# EAGLE design Adafruit 1.54inch 240x240 rev G (EAGLE 9.3.2)
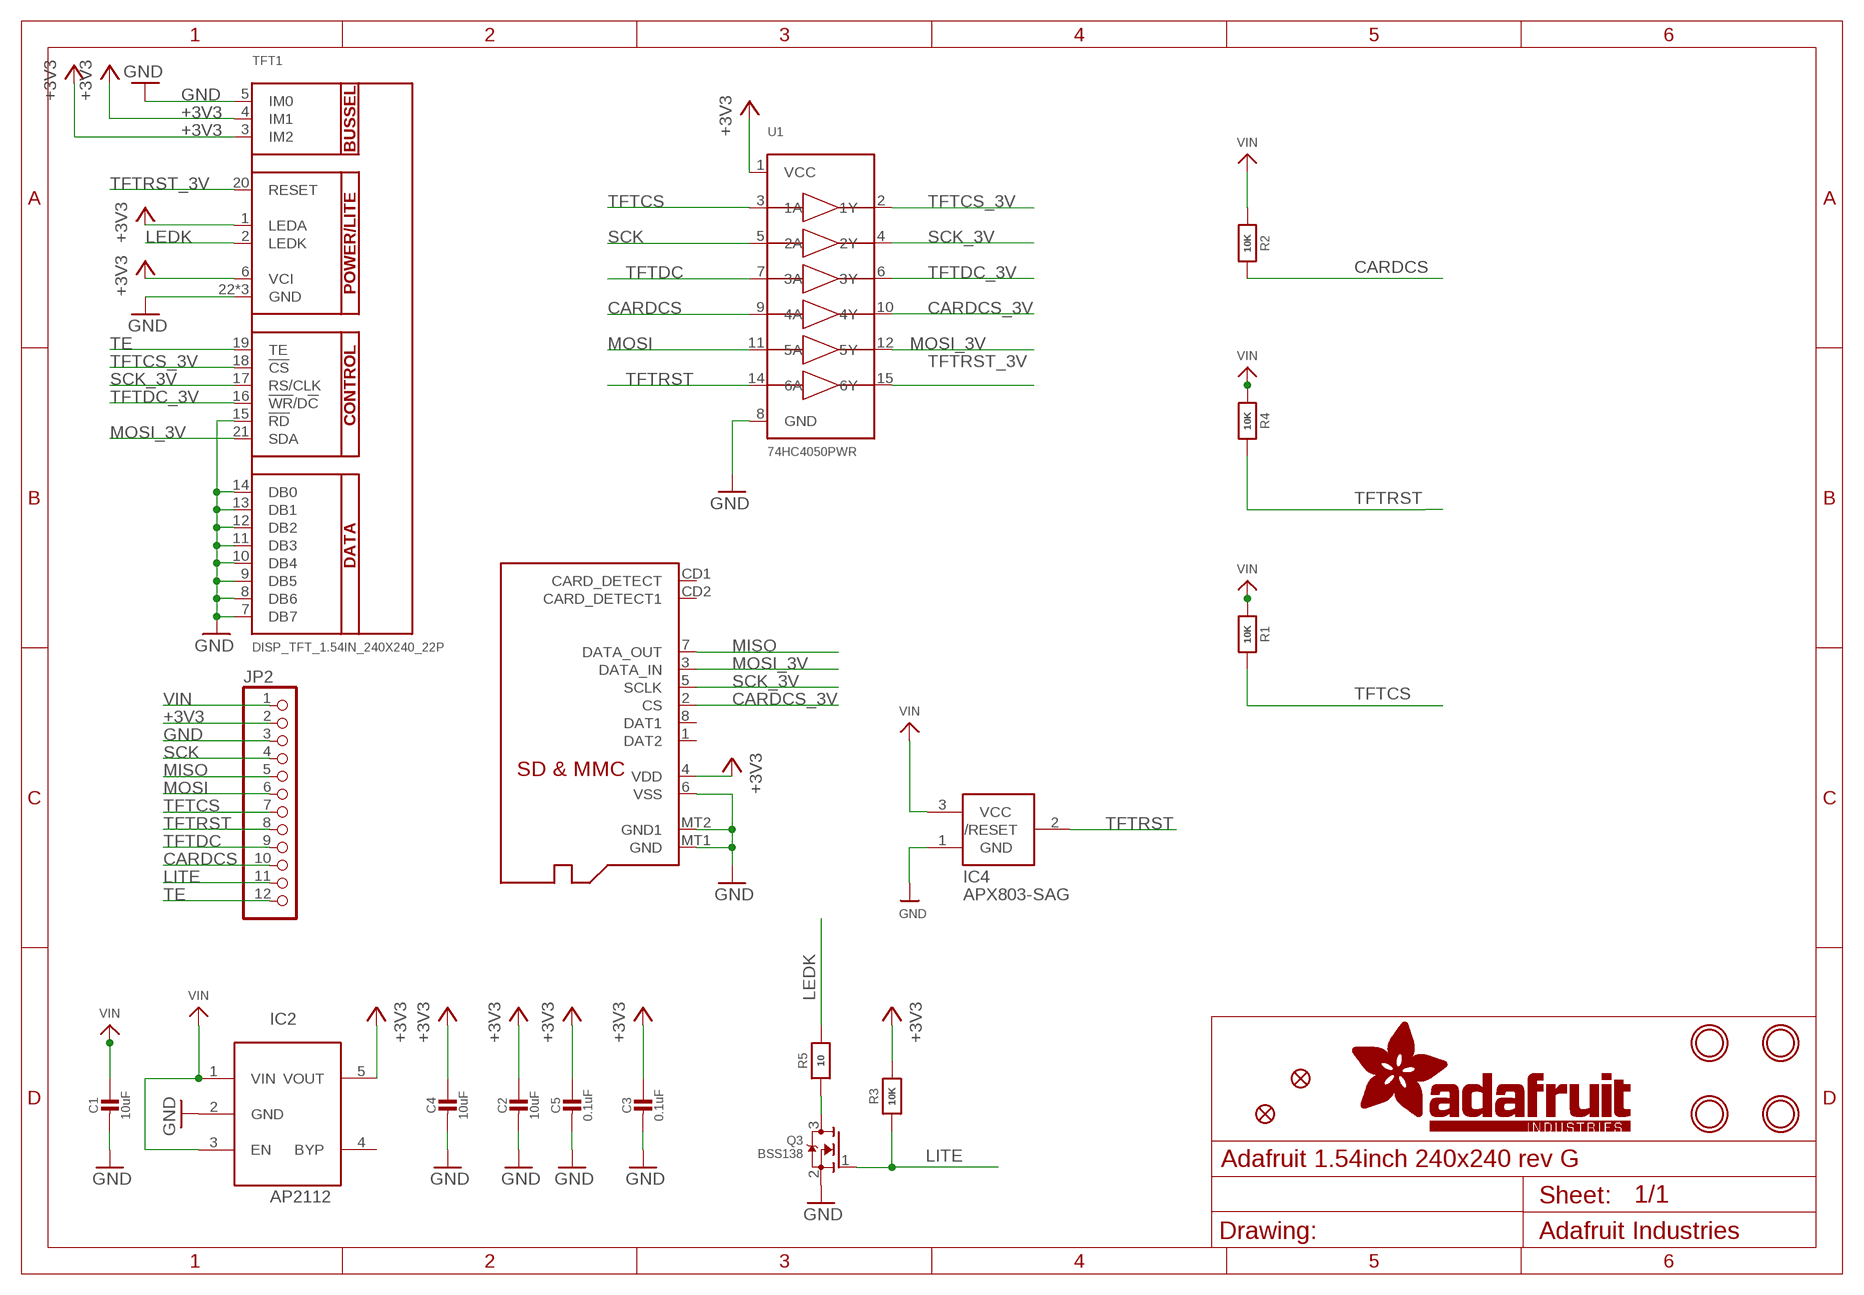
[diagram p0: schematic, sheet 1]

## Parts
C1  10uF  CAP_CERAMIC0805-NOOUTLINE  [0805-NO]
C2  10uF  CAP_CERAMIC0805-NOOUTLINE  [0805-NO]
C3  0.1uF  CAP_CERAMIC0603_NO  [0603-NO]
C4  10uF  CAP_CERAMIC0805-NOOUTLINE  [0805-NO]
C5  0.1uF  CAP_CERAMIC0603_NO  [0603-NO]
IC2  AP2112  LP298XS  [SOT23-5L]
IC4  APX803-SAG  AXP083-SAG  [SOT23]
JP2  HEADER-1X1276MIL  [1X12_ROUND_76MIL]
Q2  MICROSD  [MICROSD]
Q3  BSS138  MOSFET-NWIDE  [SOT23-WIDE]
R1  10K  RESISTOR_0603_NOOUT  [0603-NO]
R2  10K  RESISTOR_0603_NOOUT  [0603-NO]
R3  10K  RESISTOR_0603_NOOUT  [0603-NO]
R4  10K  RESISTOR_0603_NOOUT  [0603-NO]
R5  10  RESISTOR_0603_NOOUT  [0603-NO]
TFT1  DISP_TFT_1.54IN_240X240_22P  [TFT_1.54IN_240X240_22PIN]
U1  74HC4050PWR  74HC4050DTSSOP  [TSSOP16]
U$4  FIDUCIAL_1MM  [FIDUCIAL_1MM]
U$5  FIDUCIAL_1MM  [FIDUCIAL_1MM]
U$7  MOUNTINGHOLE2.5  [MOUNTINGHOLE_2.5_PLATED]
U$8  MOUNTINGHOLE2.5  [MOUNTINGHOLE_2.5_PLATED]
U$9  MOUNTINGHOLE2.5  [MOUNTINGHOLE_2.5_PLATED]
U$10  MOUNTINGHOLE2.5  [MOUNTINGHOLE_2.5_PLATED]

## Nets
+3V3 [power]: C2.1 C3.1 C4.1 C5.1 IC2.5(VOUT) JP2.2 Q2.4(VDD) R3.2 TFT1.1(LEDA) TFT1.3(IM2) TFT1.4(IM1) TFT1.6(VCI) U1.1(VCC)
CARDCS: JP2.10 R2.1 U1.9(4A)
CARDCS_3V: Q2.2(CS) U1.10(4Y)
GND: C1.2 C2.2 C3.2 C4.2 C5.2 IC2.2(GND) IC4.1(GND) JP2.3 Q2.6(VSS) Q2.MT1(GND) Q2.MT2(GND1) Q3.2(S) TFT1.5(IM0) TFT1.7(DB7) TFT1.8(DB6) TFT1.9(DB5) TFT1.10(DB4) TFT1.11(DB3) TFT1.12(DB2) TFT1.13(DB1) TFT1.14(DB0) TFT1.15(!RD) TFT1.22(GND) TFT1.SUPPORT1(GND) TFT1.SUPPORT2(GND) U1.8(GND)
LEDK: R5.2 TFT1.2(LEDK)
LITE: JP2.11 Q3.1(G) R3.1
MISO: JP2.5 Q2.7(DATA_OUT)
MOSI: JP2.6 U1.11(5A)
MOSI_3V: Q2.3(DATA_IN) TFT1.21(SDA) U1.12(5Y)
N$1: Q3.3(D) R5.1
SCK: JP2.4 U1.5(2A)
SCK_3V: Q2.5(SCLK) TFT1.17(RS/CLK) U1.4(2Y)
TE: JP2.12 TFT1.19(TE)
TFTCS: JP2.7 R1.1 U1.3(1A)
TFTCS_3V: TFT1.18(!CS) U1.2(1Y)
TFTDC: JP2.9 U1.7(3A)
TFTDC_3V: TFT1.16(!WR!/D!C) U1.6(3Y)
TFTRST: IC4.2(/RESET) JP2.8 R4.1 U1.14(6A)
TFTRST_3V: TFT1.20(RESET) U1.15(6Y)
VIN [power]: C1.1 IC2.1(VIN) IC2.3(EN) IC4.3(VCC) JP2.1 R1.2 R2.2 R4.2
Unconnected: IC2.4(BYP) Q2.1(DAT2) Q2.8(DAT1) Q2.CD1(CARD_DETECT) Q2.CD2(CARD_DETECT1)

## Library data of the parts
C1-C5 = microbuilder:CAP_CERAMIC: Ceramic Capacitors For new designs, use the packages preceded by an '_' character since they are more reliable: The following footprints should be used on most boards: _0402 - Standard footprint for regular board layouts _0603 - Standard footprint for regular board layouts _0805 - Standard footprint for regular board layouts _1206 - Standard footprint for regular board layouts For extremely tight-pitch boards where space is at a premium, the following 'micro-pitch' footprints can be used (smaller pads, no silkscreen outline, etc.): _0402MP - Micro-pitch footprint for very dense/compact boards _0603MP - Micro-pitch footprint for very dense/compact boards _0805MP - Micro-pitch footprint for very dense/compact boards _1206MP - Micro-pitch footprint for very dense/compact boards
IC2 = adafruit:LP298X
IC4 = adafruit:AXP083
JP2 = microbuilder:HEADER-1X12
Q2 = adafruit:MICROSD: Micro-SD / Transflash card holder with SPI pinout For the 3M # 2908-05WB-MG and/or 4UCON #19656 push-push type
Q3 = microbuilder:MOSFET-N: N-Channel Mosfet LEGEND VDS: Voltage Drain-Source ID: Drain Current RDS(ON): Drain-Source On-State Resistance VGS(TH): Gate-Source Threshold Voltage CISS: Drain-Source Input Capacitance SOT-23 Name VDS ID RDS(ON) VGS(TH) CISS Order Number 2N7002E 60V 260mA 2.5 Ohm 2.5V @ 250uA 26.7pF @ 25V 2N7002ET1GOSTR-ND BSH103 30V 850mA 400 mOhm 400mV @ 1mA 83pF @ 24V BSH103,235-ND BSS138 60V 320mA 1.6 Ohm 1.5V @ 250uA 50pF @ 10V Mouser: 771-BSS138PW115 DMN2075U-7 20V 4.2A 38 mOhm 1V @ 250 uA 594.3pF @ 10V DMN2075U-7DICT-ND * BSS138 good choice for I2C level-shifting POWERPAK 1212-8 Name VDS ID RDS(ON) VGS(TH) CISS Order Number Si7308DN 60V 6A 58 mOhm 3V @ 250uA 665pF @ 15V SI7308DN-T1-E3CT-ND
R1-R5 = microbuilder:RESISTOR: Resistors For new designs, use the packages preceded by an '_' character since they are more reliable: The following footprints should be used on most boards: _0402 - Standard footprint for regular board layouts _0603 - Standard footprint for regular board layouts _0805 - Standard footprint for regular board layouts _1206 - Standard footprint for regular board layouts For extremely tight-pitch boards where space is at a premium, the following 'micro-pitch' footprints can be used (smaller pads, no silkscreen outline, etc.): _0402MP - Micro-pitch footprint for very dense/compact boards _0603MP - Micro-pitch footprint for very dense/compact boards _0805MP - Micro-pitch footprint for very dense/compact boards _1206MP - Micro-pitch footprint for very dense/compact boards
TFT1 = microbuilder:DISP_TFT_1.54IN_240X240_22P
U1 = microbuilder:74HC4050D: 6-channel level shifter 74HC4050D - 2V-6V Supply SOIC16 Digikey: 74HC4050D,653-ND Mouser: 771-74HC4050D-T TSSOP16 Digikey: 296-9215-1-ND Mouser:
U$4 U$5 = microbuilder:FIDUCIAL: Fiducial Alignment Points Various fiducial points for machine vision alignment.; BOM: EXCLUDE
U$7-U$10 = microbuilder:MOUNTINGHOLE: Mounting Hole For #2 screws (0.086"/2.18mm width, 0.094"/2.4mm hole) use 2.5mm; BOM: EXCLUDE

## Net classes
1 power: width 0.254 mm

## Board
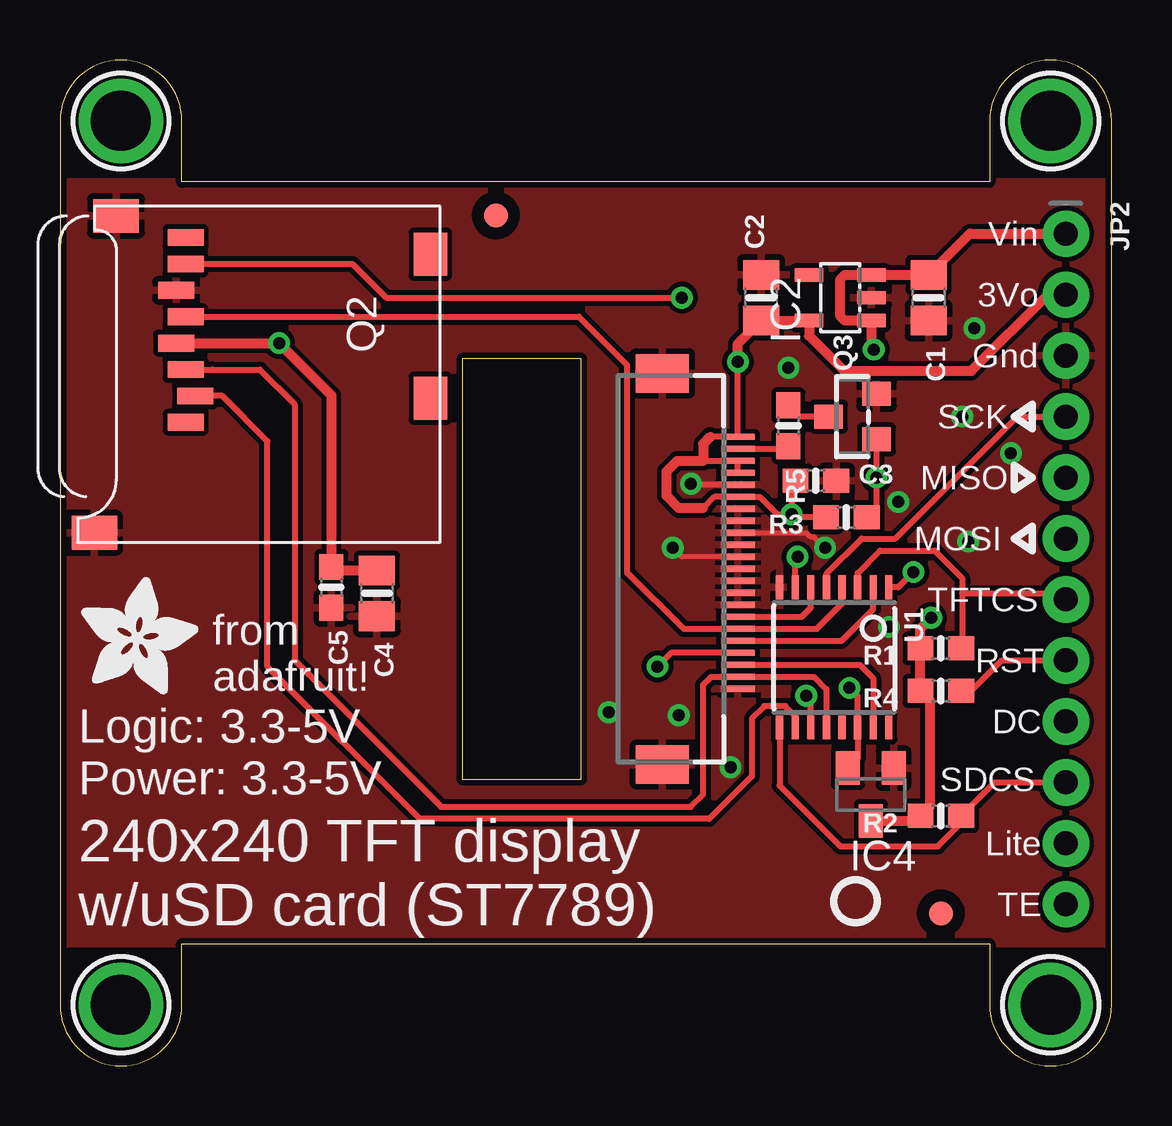
[diagram p1: board, top side]
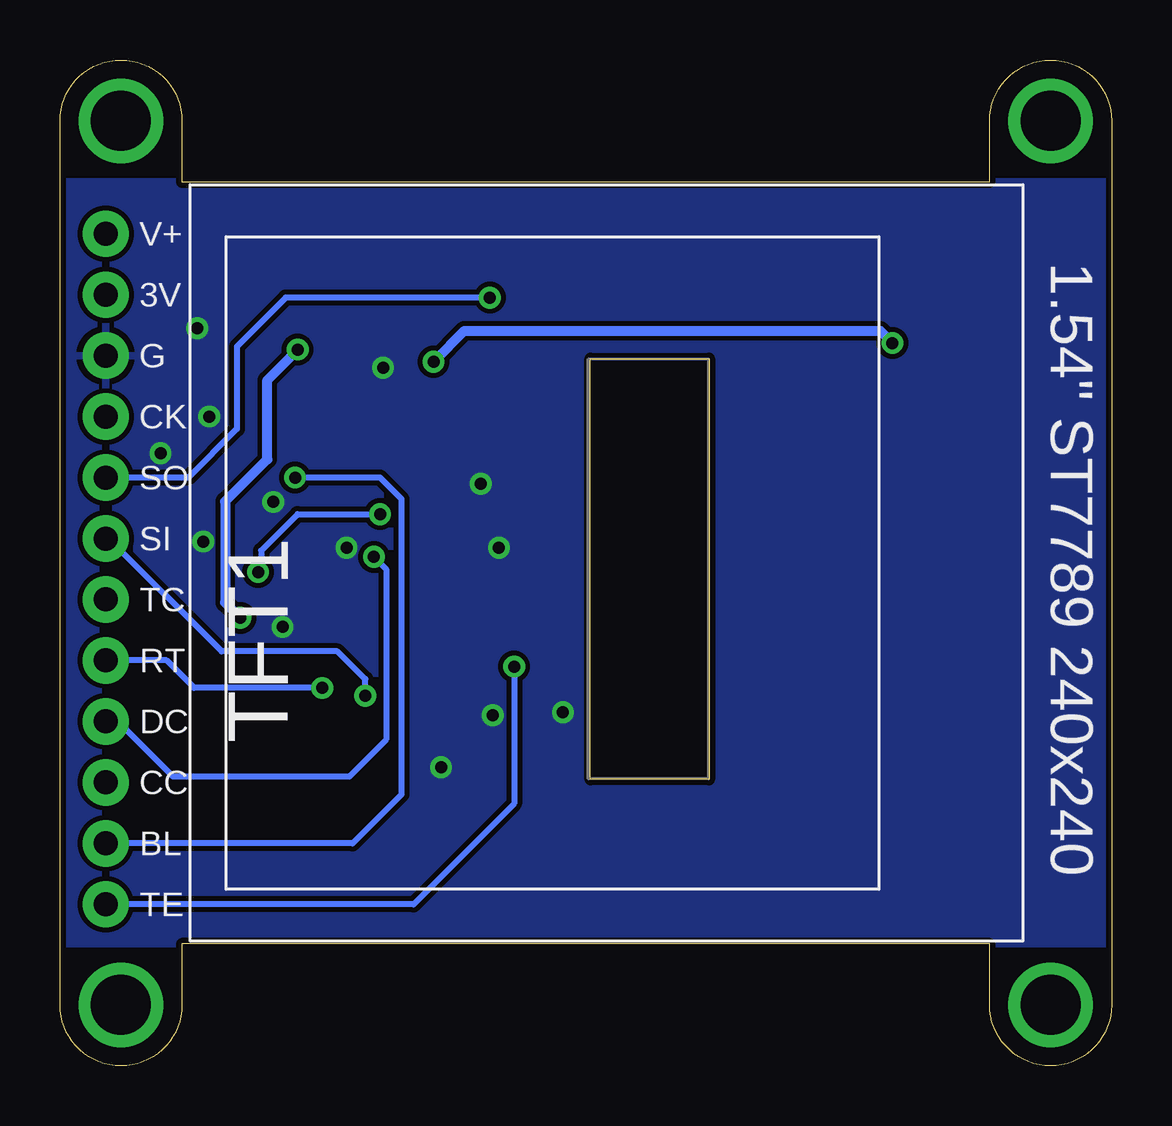
[diagram p2: board, bottom side, seen from below]

Size 43.81 x 41.91 mm. Coordinates in mm from the lower left corner, seen from the top.
Outline: 38.73,5.08 38.73,2.54 arc90 41.27,0 arc90 43.81,2.54 43.81,39.37 arc90 41.27,41.91 arc90 38.73,39.37 38.73,36.83 5.08,36.83 5.08,39.37 arc90 2.54,41.91 arc90 0,39.37 0,2.54 arc90 2.54,0 arc90 5.08,2.54 5.08,5.08 38.73,5.08
Outline: 16.76,29.46 16.76,11.94 21.72,11.94 21.72,29.46 16.76,29.46
Copper layers (1*16): Top 0.035mm / dielectric 1.5mm / Bottom 0.035mm
Design rules "adafruit *": minimum track width 8mil, minimum drill 15.5mil, track to track 8mil, track to pad 8mil, pad to pad 8mil, via to via 8mil, smd to smd 8mil, copper to edge 10mil, drill to drill 8mil, minimum pad ring 10mil, minimum via ring 8mil, stop-mask expansion 2mil, vias tented up to drill 20mil, thermal gap 10mil

### Footprints (pad centres in the part's own frame; a part is rotated, then mirrored left to right if it is on the bottom)
0805-NO = smd 1.24 x 1.5: 1 -0.95,0; 2 0.95,0
0603-NO = smd 1.075 x 1: 1 -0.85,0; 2 0.85,0
SOT23-5L = smd 0.55 x 1.2: 1 -0.95,-1.3; 2 0,-1.3; 3 0.95,-1.3; 4 0.95,1.3; 5 -0.95,1.3
SOT23 = smd 1 x 1.4: 1 -0.95,-1.1; 2 0.95,-1.1; 3 0,1.1
1X12_ROUND_76MIL = drill 1 pad 1.93: 1 -13.97,0; 2 -11.43,0; 3 -8.89,0; 4 -6.35,0; 5 -3.81,0; 6 -1.27,0; 7 1.27,0; 8 3.81,0; 9 6.35,0; 10 8.89,0; 11 11.43,0; 12 13.97,0
MICROSD = smd 0.7 x 1.5: 1 9,-10.64; 2 7.9,-10.24; 3 6.8,-10.64; 4 5.7,-11.04; 5 4.6,-10.64; 6 3.5,-11.04; 7 2.4,-10.64; 8 1.3,-10.64 | smd 1.8 x 1.4: CD1 2,-0.44; CD2 8,-0.44 | smd 1.4 x 1.9: MT1 0.4,-13.54; MT2 13.6,-14.44
SOT23-WIDE = smd 1 x 1.2: 1 -0.95,-1; 2 0.95,-1; 3 0,1
TFT_1.54IN_240X240_22PIN = smd 0.25 x 1.4 bottom: 1 5.25,2.722; 2 4.75,2.722; 3 4.25,2.722; 4 3.75,2.722; 5 3.25,2.722; 6 2.75,2.722; 7 2.25,2.722; 8 1.75,2.722; 9 1.25,2.722; 10 0.75,2.722; 11 0.25,2.722; 12 -0.25,2.722; 13 -0.75,2.722; 14 -1.25,2.722; 15 -1.75,2.722; 16 -2.25,2.722; 17 -2.75,2.722; 18 -3.25,2.722; 19 -3.75,2.722; 20 -4.25,2.722; 21 -4.75,2.722; 22 -5.25,2.722 | smd 1.6 x 2.2 bottom: SUPPORT1 7.9,-0.428; SUPPORT2 -8.4,-0.428
TSSOP16 = smd 0.305 x 0.991: 1 -2.275,-2.918; 2 -1.625,-2.918; 3 -0.975,-2.918; 4 -0.325,-2.918; 5 0.325,-2.918; 6 0.975,-2.918; 7 1.625,-2.918; 8 2.275,-2.918; 9 2.275,2.918; 10 1.625,2.918; 11 0.975,2.918; 12 0.325,2.918; 13 -0.325,2.918; 14 -0.975,2.918; 15 -1.625,2.918; 16 -2.275,2.918
FIDUCIAL_1MM = smd 1 x 1: 1 0,0
MOUNTINGHOLE_2.5_PLATED = drill 2.5 pad 3.2: P$1 0,0

### Placement (x,y rotation side)
C1  36.2,32 270 top
C2  29.21,32 90 top
C3  31.5,24.38 0 top
C4  13.21,19.69 270 top
C5  11.3,19.94 270 top
IC2  32.51,32 90 top
IC4  33.78,11.3 180 top
JP2  41.91,20.7 270 top
Q2  15.88,35.81 270 top
Q3  33.02,27.05 90 top
R1  36.7,17.4 180 top
R2  36.7,10.41 180 top
R3  32.77,22.86 180 top
R4  36.7,15.62 180 top
R5  30.35,26.67 270 top
TFT1  25.53,20.95 90 bottom
U1  32.26,17.02 180 top
U$1  [ADAFRUIT_5MM]  0.89,15.49 0 top
U$2  [PCBFEAT-REV-040]  33.15,6.86 180 top
U$4  18.16,35.43 0 top
U$5  36.7,6.35 0 top
U$7  2.54,39.37 0 top
U$8  2.54,2.54 0 top
U$9  41.27,39.37 0 top
U$10  41.27,2.54 0 top

### Tracks (layer width: path | path; a pad name or v marks a point on that pad's centre or on a via)
+3V3  (via drill 0.5)
  Top 0.254: v28.25,29.34 TFT1.1 27.09,26.2 | v30.48,22.99 29.88,22.99 29.17,23.7 TFT1.6 27.26,23.7 26.8,23.24 | 32,22.86 R3.2 30.61,22.86 v30.48,22.99 | 37.97,28.96 39.88,30.86 | v35.56,20.57 34.92,19.94 U1.1 | 11.46,20.63 C5.1 | C3.1 30.48,24.22 v30.48,22.99 | 26.8,25.2 TFT1.3 TFT1.4
  Top 0.406: v28.25,29.34 28.25,30.09 C2.1 IC2.5 31.21,30.42 32.67,28.96 37.97,28.96 41.15,32.13 JP2.2 | C4.1 11.46,20.63 | Q2.4 v9.13,30.11 11.3,27.94 C5.1 | 26.8,23.24 25.78,23.24 25.27,23.75 25.27,24.77 25.71,25.2 26.8,25.2 26.8,25.91 27.09,26.2
  Bottom 0.254: v35.56,20.57 35.43,20.7 35.43,21.46 33.91,22.99 v30.48,22.99
  Bottom 0.406: v9.13,30.11 9.64,30.62 26.96,30.62 v28.25,29.34
CARDCS
  Top 0.254: U1.9 29.98,11.67 32.51,9.14 36.58,9.14 37.55,10.12 R2.1 38.95,11.81 JP2.10
CARDCS_3V
  Top 0.254: U1.10 30.63,14.58 30.23,14.99 29.34,14.99 28.83,14.48 28.83,12.07 27.05,10.29 14.99,10.29 8.64,16.64 8.64,26.03 6.76,27.91 Q2.2
GND  (via drill 0.5)
  Top 0.203: TFT1.9 31.1,22.2 31.25,22.05 31.41,22.05 v31.88,21.59 | TFT1.11 25.91,21.2 v25.53,21.59
  Top 0.254: TFT1.5 26.34,24.2 v26.29,24.26
  other vias: 25.78,14.61 27.94,12.45 37.85,21.84 34.92,23.49 39.62,25.53 37.59,27.05 30.35,29.08 38.1,30.73 34.54,18.29 22.86,14.73
  pour Top: 0,5.08 0,36.83 43.56,36.83 43.56,5.08
  pour Bottom: 0,5.08 0,36.83 43.56,36.83 43.56,5.08
LEDK
  Top 0.254: TFT1.2 30.47,25.7 R5.2
LITE  (via drill 0.5)
  Top 0.254: Q3.1 v34.02,24.51 34.02,23.26 R3.1
  Bottom 0.254: v34.02,24.51 30.48,24.51 29.59,23.62 29.59,11.3 31.62,9.27 JP2.11
MISO  (via drill 0.5)
  Top 0.254: Q2.7 12.18,33.41 13.59,32 v25.91,32
  Bottom 0.254: v25.91,32 34.42,32 36.45,29.97 36.45,26.54 38.48,24.51 JP2.5
MOSI  (via drill 0.5)
  Top 0.254: U1.11 31.28,15.2 31.09,15.39 v31.09,15.42
  Bottom 0.254: v31.09,15.42 31.09,16.11 32.26,17.27 37.08,17.27 41.78,21.97 JP2.6
MOSI_3V
  Top 0.254: U1.12 31.93,15.69 31.42,16.2 TFT1.21 27.13,16.2 26.8,15.88 26.8,11.3 26.29,10.79 15.88,10.79 9.78,16.89 9.78,27.56 8.32,29.01 6.35,29.01 Q2.3 | Q2.3
N$1
  Top 0.254: Q3.3 30.82,27.05 R5.1
SCK
  Top 0.254: U1.5 31.93,20.5 33.4,21.97 34.8,21.97 38.61,25.78 39.88,27.05 JP2.4
SCK_3V
  Top 0.254: U1.4 32.58,19.25 31.54,18.2 TFT1.17 25.99,18.2 23.62,20.57 23.62,29.21 21.62,31.21 Q2.5
TE  (via drill 0.5)
  Top 0.254: TFT1.19 25.46,17.2 v24.89,16.64
  Bottom 0.254: v24.89,16.64 24.89,10.92 29.08,6.73 JP2.12
TFTCS
  Top 0.254: R1.1 37.59,17.4 37.59,19.69 | U1.3 33.23,20.53 34.16,21.46 36.45,21.46 37.59,20.32 37.59,19.69 | 37.59,19.69 41.66,19.69 JP2.7
TFTCS_3V
  Top 0.254: TFT1.18 32.56,17.7 33.88,19.02 U1.2
TFTDC  (via drill 0.5)
  Top 0.254: U1.7 30.63,21.11 v30.73,21.21
  Bottom 0.254: v30.73,21.21 30.23,20.7 30.23,13.59 31.75,12.07 39.12,12.07 39.24,12.19 40.13,13.08 41.4,14.35 JP2.9
TFTDC_3V
  Top 0.254: TFT1.16 30.9,18.7 31.28,19.09 U1.6
TFTRST  (via drill 0.5)
  Top 0.254: v32.89,15.75 33.23,15.41 U1.14 33.23,12.8 IC4.2 | R4.1 37.97,15.62 39.24,16.89 JP2.8
  Bottom 0.254: v32.89,15.75 38.23,15.75 39.37,16.89 JP2.8
TFTRST_3V
  Top 0.254: TFT1.20 33.33,16.7 33.88,16.16 U1.15
VIN  (via drill 0.5)
  Top 0.254: C1.1 36.64,33.4 | 36.23,10.79 R2.2 35.64,10.2
  Top 0.406: 36.23,10.79 36.23,15.24 R4.2 R1.2 35.85,18.22 v36.3,18.67 | v33.91,29.84 33.81,29.94 IC2.1 32.7,31.05 32.51,31.24 32.51,32.77 32.7,32.95 IC2.3 C1.1 37.91,34.67 JP2.1 | IC4.3 35.64,10.2
  Bottom 0.406: v36.3,18.67 36.94,19.3 36.94,23.52 35.18,25.27 35.18,28.58 v33.91,29.84

### Text on the board
tPlace: Vin | 3Vo | Gnd | SCK | MISO | MOSI | TFTCS | RST | from / adafruit! | DC | Logic: 3.3-5V | SDCS | Power: 3.3-5V | Lite | 240x240 TFT display | TE | w/uSD card (ST7789)
bPlace: V+ | 3V | G | CK | SO | SI | 1.54" ST7789 240x240 | TC | RT | DC | CC | BL | TE